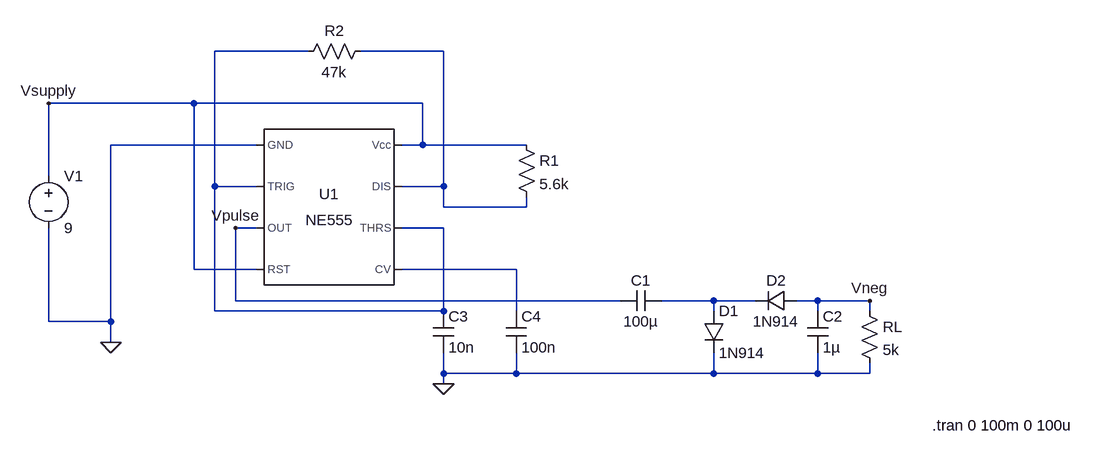
[diagram p0: schematic Negative_voltage_supply.asc]
Negative_voltage_supply.asc, the LTspice schematic file:
Version 4
SHEET 1 896 680
WIRE -304 -128 -448 -128
WIRE -96 -128 -224 -128
WIRE -480 -48 -704 -48
WIRE -128 -48 -480 -48
WIRE -384 16 -608 16
WIRE -128 16 -128 -48
WIRE -128 16 -160 16
WIRE 32 16 -128 16
WIRE -704 64 -704 -48
WIRE -448 80 -448 -128
WIRE -384 80 -448 80
WIRE -96 80 -96 -128
WIRE -96 80 -160 80
WIRE -96 112 -96 80
WIRE 32 112 32 96
WIRE 32 112 -96 112
WIRE -384 144 -416 144
WIRE -96 144 -160 144
WIRE -480 208 -480 -48
WIRE -384 208 -480 208
WIRE 16 208 -160 208
WIRE -416 256 -416 144
WIRE 176 256 -416 256
WIRE 320 256 240 256
WIRE 384 256 320 256
WIRE 480 256 448 256
WIRE 560 256 480 256
WIRE -448 272 -448 80
WIRE -96 272 -96 144
WIRE -96 272 -448 272
WIRE 16 272 16 208
WIRE 320 272 320 256
WIRE 480 272 480 256
WIRE 560 272 560 256
WIRE -704 288 -704 144
WIRE -608 288 -608 16
WIRE -608 288 -704 288
WIRE -608 320 -608 288
WIRE -96 368 -96 336
WIRE 16 368 16 336
WIRE 16 368 -96 368
WIRE 320 368 320 336
WIRE 320 368 16 368
WIRE 480 368 480 336
WIRE 480 368 320 368
WIRE 560 368 560 352
WIRE 560 368 480 368
WIRE -96 384 -96 368
FLAG -608 320 0
FLAG -96 384 0
FLAG 560 256 Vneg
FLAG -704 -48 Vsupply
FLAG -416 144 Vpulse
SYMBOL Misc\\NE555 -272 112 R0
SYMATTR InstName U1
SYMBOL res -208 -144 R90
WINDOW 0 0 56 VBottom 2
WINDOW 3 32 56 VTop 2
SYMATTR InstName R2
SYMATTR Value 47k
SYMBOL voltage -704 48 R0
WINDOW 123 0 0 Left 0
WINDOW 39 0 0 Left 0
SYMATTR InstName V1
SYMATTR Value 9
SYMBOL res 16 0 R0
SYMATTR InstName R1
SYMATTR Value 5.6k
SYMBOL cap -112 272 R0
SYMATTR InstName C3
SYMATTR Value 10n
SYMBOL cap 0 272 R0
SYMATTR InstName C4
SYMATTR Value 100n
SYMBOL cap 240 240 R90
WINDOW 0 0 32 VBottom 2
WINDOW 3 32 32 VTop 2
SYMATTR InstName C1
SYMATTR Value 100µ
SYMBOL diode 304 272 R0
SYMATTR InstName D1
SYMATTR Value 1N914
SYMBOL diode 448 240 R90
WINDOW 0 0 32 VBottom 2
WINDOW 3 32 32 VTop 2
SYMATTR InstName D2
SYMATTR Value 1N914
SYMBOL cap 464 272 R0
SYMATTR InstName C2
SYMATTR Value 1µ
SYMBOL res 544 256 R0
SYMATTR InstName RL
SYMATTR Value 5k
TEXT 656 448 Left 2 !.tran 0 100m 0 100u

The netlist it stands for:
* Negative_voltage_supply.asc
XU1 0 N001 Vpulse Vsupply N003 N001 N002 Vsupply NE555  ; pins GND TRIG OUT RST CV THRS DIS Vcc
R2 N002 N001 47k
V1 Vsupply 0 9
R1 Vsupply N002 5.6k
C3 N001 0 10n
C4 N003 0 100n
C1 N004 Vpulse 100µ
D1 N004 0 1N914
D2 Vneg N004 1N914
C2 Vneg 0 1µ
RL Vneg 0 5k
.model D D
.lib standard.dio
.tran 0 100m 0 100u
.lib NE555.sub
.backanno
.end